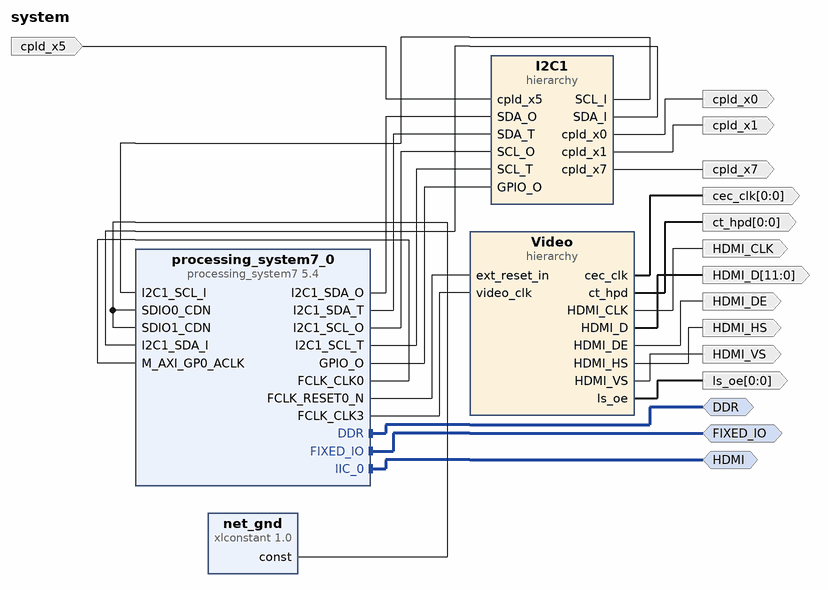
[diagram p0: block diagram of the top level]
# Vivado block design system, Vivado 2014.1
create_bd_design system

create_bd_intf_port -mode Master -vlnv xilinx.com:interface:ddrx_rtl:1.0 DDR
create_bd_intf_port -mode Master -vlnv xilinx.com:display_processing_system7:fixedio_rtl:1.0 FIXED_IO
create_bd_intf_port -mode Master -vlnv xilinx.com:interface:iic_rtl:1.0 HDMI
create_bd_port -dir O cpld_x1
create_bd_port -dir O cpld_x7
create_bd_port -dir I cpld_x5
create_bd_port -dir O cpld_x0
create_bd_port -dir O HDMI_CLK
create_bd_port -dir O -from 11 -to 0 HDMI_D
create_bd_port -dir O -from 0 -to 0 cec_clk
create_bd_port -dir O -from 0 -to 0 ct_hpd
create_bd_port -dir O -from 0 -to 0 ls_oe
create_bd_port -dir O HDMI_DE
create_bd_port -dir O HDMI_VS
create_bd_port -dir O HDMI_HS

create_bd_cell -type ip -vlnv xilinx.com:ip:processing_system7:5.4 processing_system7_0
set_property -dict [list \
  CONFIG.PCW_UIPARAM_DDR_FREQ_MHZ 533 \
  CONFIG.PCW_APU_PERIPHERAL_FREQMHZ 666 \
  CONFIG.PCW_SDIO_PERIPHERAL_FREQMHZ 50 \
  CONFIG.PCW_FPGA0_PERIPHERAL_FREQMHZ 100 \
  CONFIG.PCW_FPGA1_PERIPHERAL_FREQMHZ 200 \
  CONFIG.PCW_FPGA2_PERIPHERAL_FREQMHZ 150 \
  CONFIG.PCW_FPGA3_PERIPHERAL_FREQMHZ 75 \
  CONFIG.PCW_EN_CLK1_PORT 1 \
  CONFIG.PCW_EN_CLK2_PORT 1 \
  CONFIG.PCW_EN_CLK3_PORT 1 \
  CONFIG.PCW_PRESET_BANK1_VOLTAGE {LVCMOS 1.8V} \
  CONFIG.PCW_UIPARAM_DDR_PARTNO {MT41J256M16 RE-125} \
  CONFIG.PCW_QSPI_PERIPHERAL_ENABLE 1 \
  CONFIG.PCW_QSPI_GRP_FBCLK_ENABLE 1 \
  CONFIG.PCW_ENET0_PERIPHERAL_ENABLE 1 \
  CONFIG.PCW_ENET0_ENET0_IO {MIO 16 .. 27} \
  CONFIG.PCW_ENET0_GRP_MDIO_ENABLE 1 \
  CONFIG.PCW_SD0_PERIPHERAL_ENABLE 1 \
  CONFIG.PCW_SD0_GRP_CD_ENABLE 1 \
  CONFIG.PCW_SD1_PERIPHERAL_ENABLE 1 \
  CONFIG.PCW_SD1_SD1_IO {MIO 46 .. 51} \
  CONFIG.PCW_SD1_GRP_CD_ENABLE 1 \
  CONFIG.PCW_UART0_PERIPHERAL_ENABLE 1 \
  CONFIG.PCW_UART0_UART0_IO {MIO 14 .. 15} \
  CONFIG.PCW_UART1_PERIPHERAL_ENABLE 1 \
  CONFIG.PCW_UART1_UART1_IO {MIO 12 .. 13} \
  CONFIG.PCW_TTC0_PERIPHERAL_ENABLE 1 \
  CONFIG.PCW_USB0_PERIPHERAL_ENABLE 1 \
  CONFIG.PCW_I2C0_PERIPHERAL_ENABLE 1 \
  CONFIG.PCW_I2C1_PERIPHERAL_ENABLE 1 \
  CONFIG.PCW_GPIO_MIO_GPIO_ENABLE 1 \
  CONFIG.PCW_GPIO_EMIO_GPIO_ENABLE 1 \
  CONFIG.PCW_GPIO_EMIO_GPIO_IO 1 \
] [get_bd_cells processing_system7_0]
# 87 more settings of processing_system7_0 are not shown: defaults, MIO pin electricals, DDR timing, and values the tool derives
create_bd_cell -type ip -vlnv xilinx.com:ip:xlconstant:1.0 net_gnd
set_property -dict {CONFIG.CONST_VAL 0} [get_bd_cells net_gnd]
create_bd_cell -type hier I2C1
create_bd_cell -type hier Video

# ---- hierarchy /I2C1 ----
current_bd_instance /I2C1
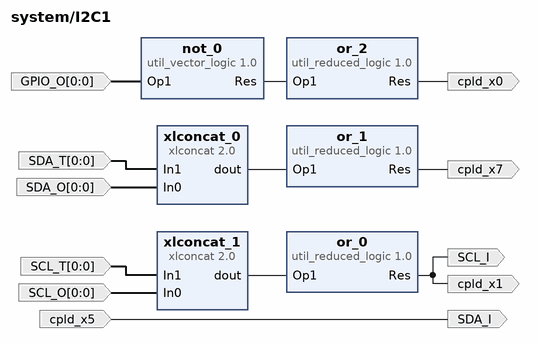
[diagram p1: block diagram inside /I2C1]
create_bd_pin -dir I -from 0 -to 0 GPIO_O
create_bd_pin -dir I -from 0 -to 0 SCL_T
create_bd_pin -dir I -from 0 -to 0 SCL_O
create_bd_pin -dir I -from 0 -to 0 SDA_T
create_bd_pin -dir I -from 0 -to 0 SDA_O
create_bd_pin -dir O cpld_x1
create_bd_pin -dir O cpld_x7
create_bd_pin -dir O SCL_I
create_bd_pin -dir I cpld_x5
create_bd_pin -dir O SDA_I
create_bd_pin -dir O cpld_x0

create_bd_cell -type ip -vlnv xilinx.com:ip:util_reduced_logic:1.0 or_0
set_property -dict {CONFIG.C_SIZE 2 CONFIG.C_OPERATION or} [get_bd_cells or_0]
create_bd_cell -type ip -vlnv xilinx.com:ip:util_reduced_logic:1.0 or_1
set_property -dict {CONFIG.C_SIZE 2 CONFIG.C_OPERATION or} [get_bd_cells or_1]
create_bd_cell -type ip -vlnv xilinx.com:ip:util_vector_logic:1.0 not_0
set_property -dict {CONFIG.C_SIZE 1 CONFIG.C_OPERATION not} [get_bd_cells not_0]
create_bd_cell -type ip -vlnv xilinx.com:ip:xlconcat:2.0 xlconcat_0
create_bd_cell -type ip -vlnv xilinx.com:ip:xlconcat:2.0 xlconcat_1
create_bd_cell -type ip -vlnv xilinx.com:ip:util_reduced_logic:1.0 or_2
set_property -dict {CONFIG.C_SIZE 1 CONFIG.C_OPERATION or} [get_bd_cells or_2]

# ---- hierarchy /Video ----
current_bd_instance /Video
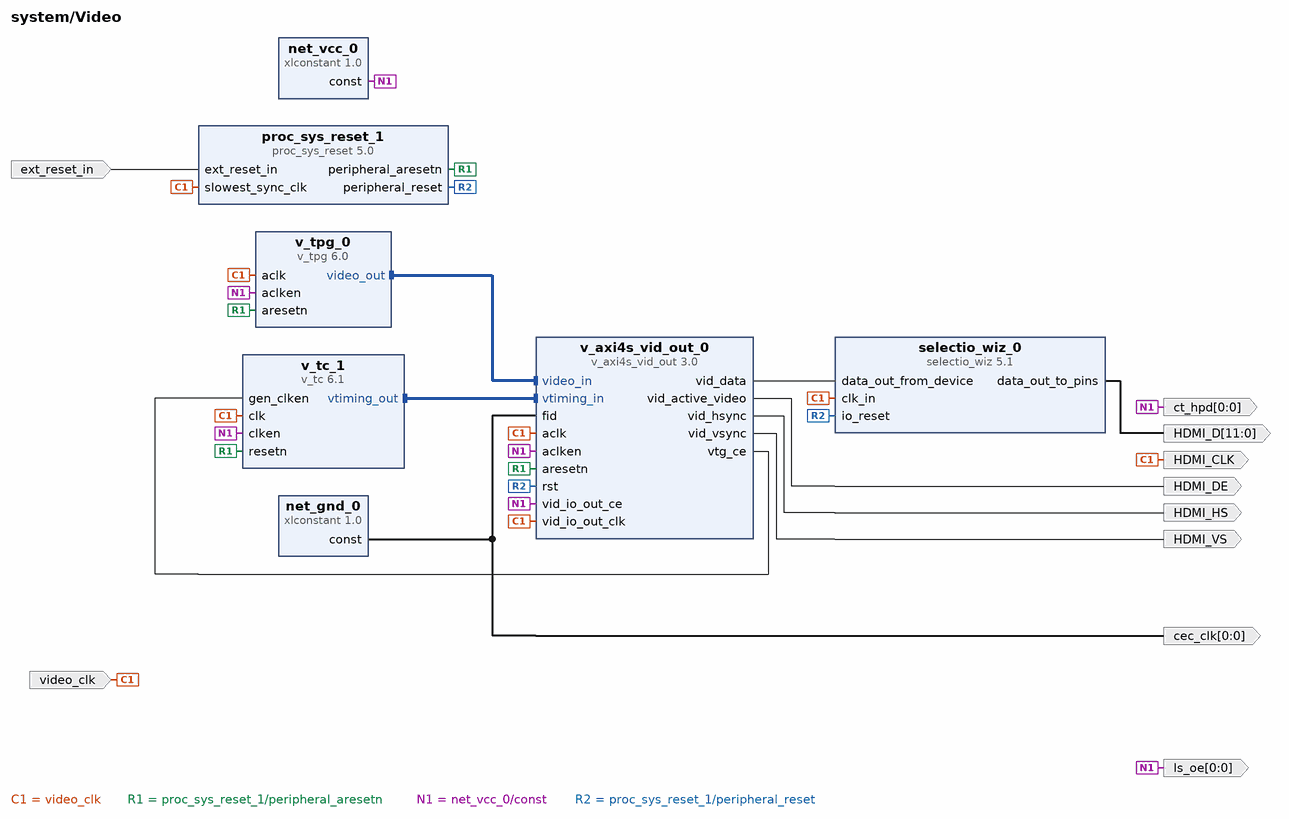
[diagram p2: block diagram inside /Video]
create_bd_pin -dir I -type clk video_clk
create_bd_pin -dir I -type rst ext_reset_in
create_bd_pin -dir O HDMI_CLK
create_bd_pin -dir O HDMI_HS
create_bd_pin -dir O HDMI_VS
create_bd_pin -dir O HDMI_DE
create_bd_pin -dir O -from 11 -to 0 HDMI_D
create_bd_pin -dir O -from 0 -to 0 cec_clk
create_bd_pin -dir O -from 0 -to 0 ct_hpd
create_bd_pin -dir O -from 0 -to 0 ls_oe

create_bd_cell -type ip -vlnv xilinx.com:ip:xlconstant:1.0 net_vcc_0
create_bd_cell -type ip -vlnv xilinx.com:ip:v_axi4s_vid_out:3.0 v_axi4s_vid_out_0
set_property -dict {CONFIG.C_S_AXIS_VIDEO_DATA_WIDTH 8 CONFIG.C_S_AXIS_VIDEO_FORMAT 2} [get_bd_cells v_axi4s_vid_out_0]
create_bd_cell -type ip -vlnv xilinx.com:ip:xlconstant:1.0 net_gnd_0
set_property -dict {CONFIG.CONST_VAL 0} [get_bd_cells net_gnd_0]
create_bd_cell -type ip -vlnv xilinx.com:ip:proc_sys_reset:5.0 proc_sys_reset_1
create_bd_cell -type ip -vlnv xilinx.com:ip:selectio_wiz:5.1 selectio_wiz_0
set_property -dict [list \
  CONFIG.BUS_DIR OUTPUTS \
  CONFIG.BUS_IO_STD LVCMOS25 \
  CONFIG.SELIO_ACTIVE_EDGE DDR \
  CONFIG.SYSTEM_DATA_WIDTH 12 \
  CONFIG.SELIO_CLK_BUF MMCM \
] [get_bd_cells selectio_wiz_0]
create_bd_cell -type ip -vlnv xilinx.com:ip:v_tc:6.1 v_tc_1
set_property -dict [list \
  CONFIG.HAS_AXI4_LITE false \
  CONFIG.horizontal_sync_generation true \
  CONFIG.enable_detection false \
  CONFIG.horizontal_blank_generation true \
] [get_bd_cells v_tc_1]
create_bd_cell -type ip -vlnv xilinx.com:ip:v_tpg:6.0 v_tpg_0
set_property -dict [list \
  CONFIG.has_axi4_lite false \
  CONFIG.data_width 8 \
  CONFIG.pattern_control 10 \
  CONFIG.active_cols 1280 \
  CONFIG.active_rows 720 \
  CONFIG.m_video_format 2 \
  CONFIG.motion_speed 10 \
] [get_bd_cells v_tpg_0]

# ---- connections ----

current_bd_instance /I2C1
connect_bd_net -net Op1_1 [get_bd_pins GPIO_O] [get_bd_pins not_0/Op1]
connect_bd_net [get_bd_pins not_0/Res] [get_bd_pins or_2/Op1]
connect_bd_net -net In1_1 [get_bd_pins SCL_T] [get_bd_pins xlconcat_1/In1]
connect_bd_net -net In0_1 [get_bd_pins SCL_O] [get_bd_pins xlconcat_1/In0]
connect_bd_net -net In1_2 [get_bd_pins SDA_T] [get_bd_pins xlconcat_0/In1]
connect_bd_net -net In0_2 [get_bd_pins SDA_O] [get_bd_pins xlconcat_0/In0]
connect_bd_net [get_bd_pins xlconcat_1/dout] [get_bd_pins or_0/Op1]
connect_bd_net [get_bd_pins xlconcat_0/dout] [get_bd_pins or_1/Op1]
connect_bd_net [get_bd_pins or_0/Res] [get_bd_pins cpld_x1] [get_bd_pins SCL_I]
connect_bd_net [get_bd_pins or_1/Res] [get_bd_pins cpld_x7]
connect_bd_net -net cpld_x5_1 [get_bd_pins cpld_x5] [get_bd_pins SDA_I]
connect_bd_net [get_bd_pins or_2/Res] [get_bd_pins cpld_x0]

current_bd_instance /Video
connect_bd_intf_net [get_bd_intf_pins v_tc_1/vtiming_out] [get_bd_intf_pins v_axi4s_vid_out_0/vtiming_in]
connect_bd_intf_net [get_bd_intf_pins v_tpg_0/video_out] [get_bd_intf_pins v_axi4s_vid_out_0/video_in]
connect_bd_net -net slowest_sync_clk_1 [get_bd_pins video_clk] \
  [get_bd_pins HDMI_CLK] [get_bd_pins v_axi4s_vid_out_0/aclk] [get_bd_pins v_axi4s_vid_out_0/vid_io_out_clk] \
  [get_bd_pins proc_sys_reset_1/slowest_sync_clk] [get_bd_pins selectio_wiz_0/clk_in] [get_bd_pins v_tc_1/clk] \
  [get_bd_pins v_tpg_0/aclk]
connect_bd_net -net proc_sys_reset_0_peripheral_aresetn [get_bd_pins proc_sys_reset_1/peripheral_aresetn] \
  [get_bd_pins v_axi4s_vid_out_0/aresetn] [get_bd_pins v_tc_1/resetn] [get_bd_pins v_tpg_0/aresetn]
connect_bd_net [get_bd_pins net_vcc_0/const] \
  [get_bd_pins ls_oe] [get_bd_pins ct_hpd] [get_bd_pins v_axi4s_vid_out_0/aclken] \
  [get_bd_pins v_axi4s_vid_out_0/vid_io_out_ce] [get_bd_pins v_tc_1/clken] [get_bd_pins v_tpg_0/aclken]
connect_bd_net [get_bd_pins net_gnd_0/const] [get_bd_pins cec_clk] [get_bd_pins v_axi4s_vid_out_0/fid]
connect_bd_net [get_bd_pins proc_sys_reset_1/peripheral_reset] [get_bd_pins v_axi4s_vid_out_0/rst] [get_bd_pins selectio_wiz_0/io_reset]
connect_bd_net -net ext_reset_in1_1 [get_bd_pins ext_reset_in] [get_bd_pins proc_sys_reset_1/ext_reset_in]
connect_bd_net [get_bd_pins selectio_wiz_0/data_out_to_pins] [get_bd_pins HDMI_D]
connect_bd_net [get_bd_pins v_axi4s_vid_out_0/vtg_ce] [get_bd_pins v_tc_1/gen_clken]
connect_bd_net [get_bd_pins v_axi4s_vid_out_0/vid_active_video] [get_bd_pins HDMI_DE]
connect_bd_net [get_bd_pins v_axi4s_vid_out_0/vid_hsync] [get_bd_pins HDMI_HS]
connect_bd_net [get_bd_pins v_axi4s_vid_out_0/vid_vsync] [get_bd_pins HDMI_VS]
connect_bd_net [get_bd_pins v_axi4s_vid_out_0/vid_data] [get_bd_pins selectio_wiz_0/data_out_from_device]

current_bd_instance /
connect_bd_intf_net [get_bd_intf_ports DDR] [get_bd_intf_pins processing_system7_0/DDR]
connect_bd_intf_net [get_bd_intf_ports FIXED_IO] [get_bd_intf_pins processing_system7_0/FIXED_IO]
connect_bd_intf_net [get_bd_intf_ports HDMI] [get_bd_intf_pins processing_system7_0/IIC_0]
connect_bd_net [get_bd_pins processing_system7_0/I2C1_SDA_O] [get_bd_pins I2C1/SDA_O]
connect_bd_net [get_bd_pins processing_system7_0/I2C1_SDA_T] [get_bd_pins I2C1/SDA_T]
connect_bd_net [get_bd_pins processing_system7_0/I2C1_SCL_O] [get_bd_pins I2C1/SCL_O]
connect_bd_net [get_bd_pins processing_system7_0/I2C1_SCL_T] [get_bd_pins I2C1/SCL_T]
connect_bd_net [get_bd_pins processing_system7_0/FCLK_CLK0] [get_bd_pins processing_system7_0/M_AXI_GP0_ACLK]
connect_bd_net [get_bd_pins processing_system7_0/FCLK_RESET0_N] [get_bd_pins Video/ext_reset_in]
connect_bd_net [get_bd_pins processing_system7_0/FCLK_CLK3] [get_bd_pins Video/video_clk]
connect_bd_net [get_bd_pins net_gnd/const] [get_bd_pins processing_system7_0/SDIO0_CDN] [get_bd_pins processing_system7_0/SDIO1_CDN]
connect_bd_net [get_bd_pins processing_system7_0/GPIO_O] [get_bd_pins I2C1/GPIO_O]
connect_bd_net -net I2C1_Res1 [get_bd_pins I2C1/cpld_x1] [get_bd_ports cpld_x1]
connect_bd_net -net I2C1_Res2 [get_bd_pins I2C1/cpld_x7] [get_bd_ports cpld_x7]
connect_bd_net [get_bd_pins I2C1/SCL_I] [get_bd_pins processing_system7_0/I2C1_SCL_I]
connect_bd_net [get_bd_pins I2C1/SDA_I] [get_bd_pins processing_system7_0/I2C1_SDA_I]
connect_bd_net -net cpld_x5_1 [get_bd_ports cpld_x5] [get_bd_pins I2C1/cpld_x5]
connect_bd_net [get_bd_pins I2C1/cpld_x0] [get_bd_ports cpld_x0]
connect_bd_net [get_bd_pins Video/HDMI_CLK] [get_bd_ports HDMI_CLK]
connect_bd_net [get_bd_pins Video/HDMI_D] [get_bd_ports HDMI_D]
connect_bd_net [get_bd_pins Video/cec_clk] [get_bd_ports cec_clk]
connect_bd_net [get_bd_pins Video/ct_hpd] [get_bd_ports ct_hpd]
connect_bd_net [get_bd_pins Video/ls_oe] [get_bd_ports ls_oe]
connect_bd_net [get_bd_pins Video/HDMI_DE] [get_bd_ports HDMI_DE]
connect_bd_net [get_bd_pins Video/HDMI_VS] [get_bd_ports HDMI_VS]
connect_bd_net [get_bd_pins Video/HDMI_HS] [get_bd_ports HDMI_HS]

validate_bd_design
save_bd_design
